# EAGLE design Follower (EAGLE 9.3.2)
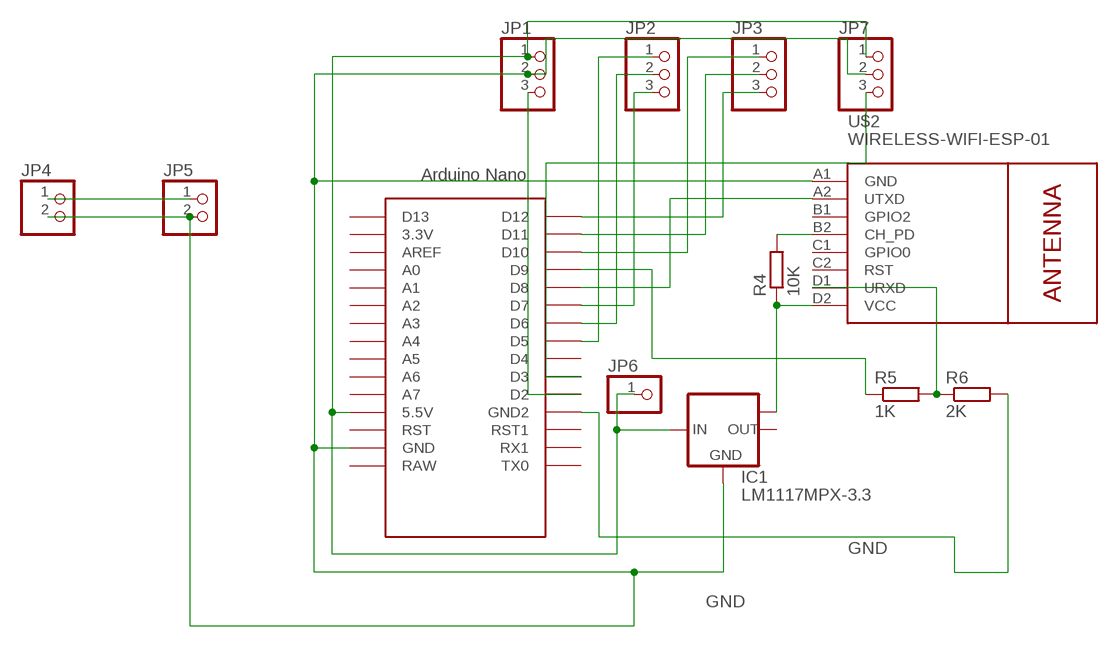
[diagram p0: schematic, sheet 1]

## Parts
IC1  LM1117MPX-3.3  [SOT223]
JP1  PINHD-1X3  [1X03]
JP2  PINHD-1X3  [1X03]
JP3  PINHD-1X3  [1X03]
JP4  PINHD-1X2  [1X02]
JP5  PINHD-1X2  [1X02]
JP6  PINHD-1X1  [1X01]
JP7  PINHD-1X3  [1X03]
R4  10K  R-EU_0207/10  [0207/10]
R5  1K  R-EU_0207/10  [0207/10]
R6  2K  R-EU_0207/10  [0207/10]
U$1  NANO  [NANO]
U$2  WIRELESS-WIFI-ESP-01  [WIRELESS-WIFI-ESP-01]

## Nets
7.4V: JP4.1 JP5.1
GND: IC1.1(GND) JP1.2 JP4.2 JP5.2 JP7.2 R6.2 U$1.GND U$1.GND1(GND2) U$2.A1(GND)
N$1: IC1.3(IN) JP1.1 JP6.1 JP7.1 U$1.5V(5.5V)
N$2: U$1.D8 U$2.A2(UTXD)
N$3: R4.2 U$2.B2(CH_PD)
N$4: IC1.TAB(OUT1) R4.1 U$2.D2(VCC)
N$5: R5.1 U$1.D9
N$6: R5.2 R6.1 U$2.D1(URXD)
N$8: JP2.1 U$1.D5
N$9: JP2.2 U$1.D6
N$10: JP2.3 U$1.D7
N$11: JP3.1 U$1.D10
N$12: JP3.2 U$1.D11
N$13: JP3.3 U$1.D12
N$15: JP1.3 U$1.D2
N$16: JP7.3 U$1.D3
Unconnected: IC1.2(OUT) U$1.3.3V U$1.A0 U$1.A1 U$1.A2 U$1.A3 U$1.A4 U$1.A5 U$1.A6 U$1.A7 U$1.AREF U$1.D4 U$1.D13 U$1.ICSP1 U$1.ICSP2 U$1.ICSP3 U$1.ICSP4 U$1.ICSP5 U$1.ICSP6 U$1.RAW U$1.RST U$1.RST1 U$1.RX1 U$1.TX0 U$2.B1(GPIO2) U$2.C1(GPIO0) U$2.C2(RST)

## Library data of the parts
IC1 = lm1117:LM1117MPX-*
JP1-JP3 JP7 = pinhead:PINHD-1X3: PIN HEADER
JP4 JP5 = pinhead:PINHD-1X2: PIN HEADER
JP6 = pinhead:PINHD-1X1: PIN HEADER
R4-R6 = rcl:R-EU_: RESISTOR, European symbol; SPICEPREFIX: R
U$1 = Arduino-clone:NANO: Arduino Nano
U$2 = diy-modules:WIRELESS-WIFI-ESP-01: Wireless Wi-Fi ESP-01 Module based on ESP8266 chip Click here to find device on ebay.com <http://www.ebay.com/sch/esp8266+esp+01+transceiver>

## Board
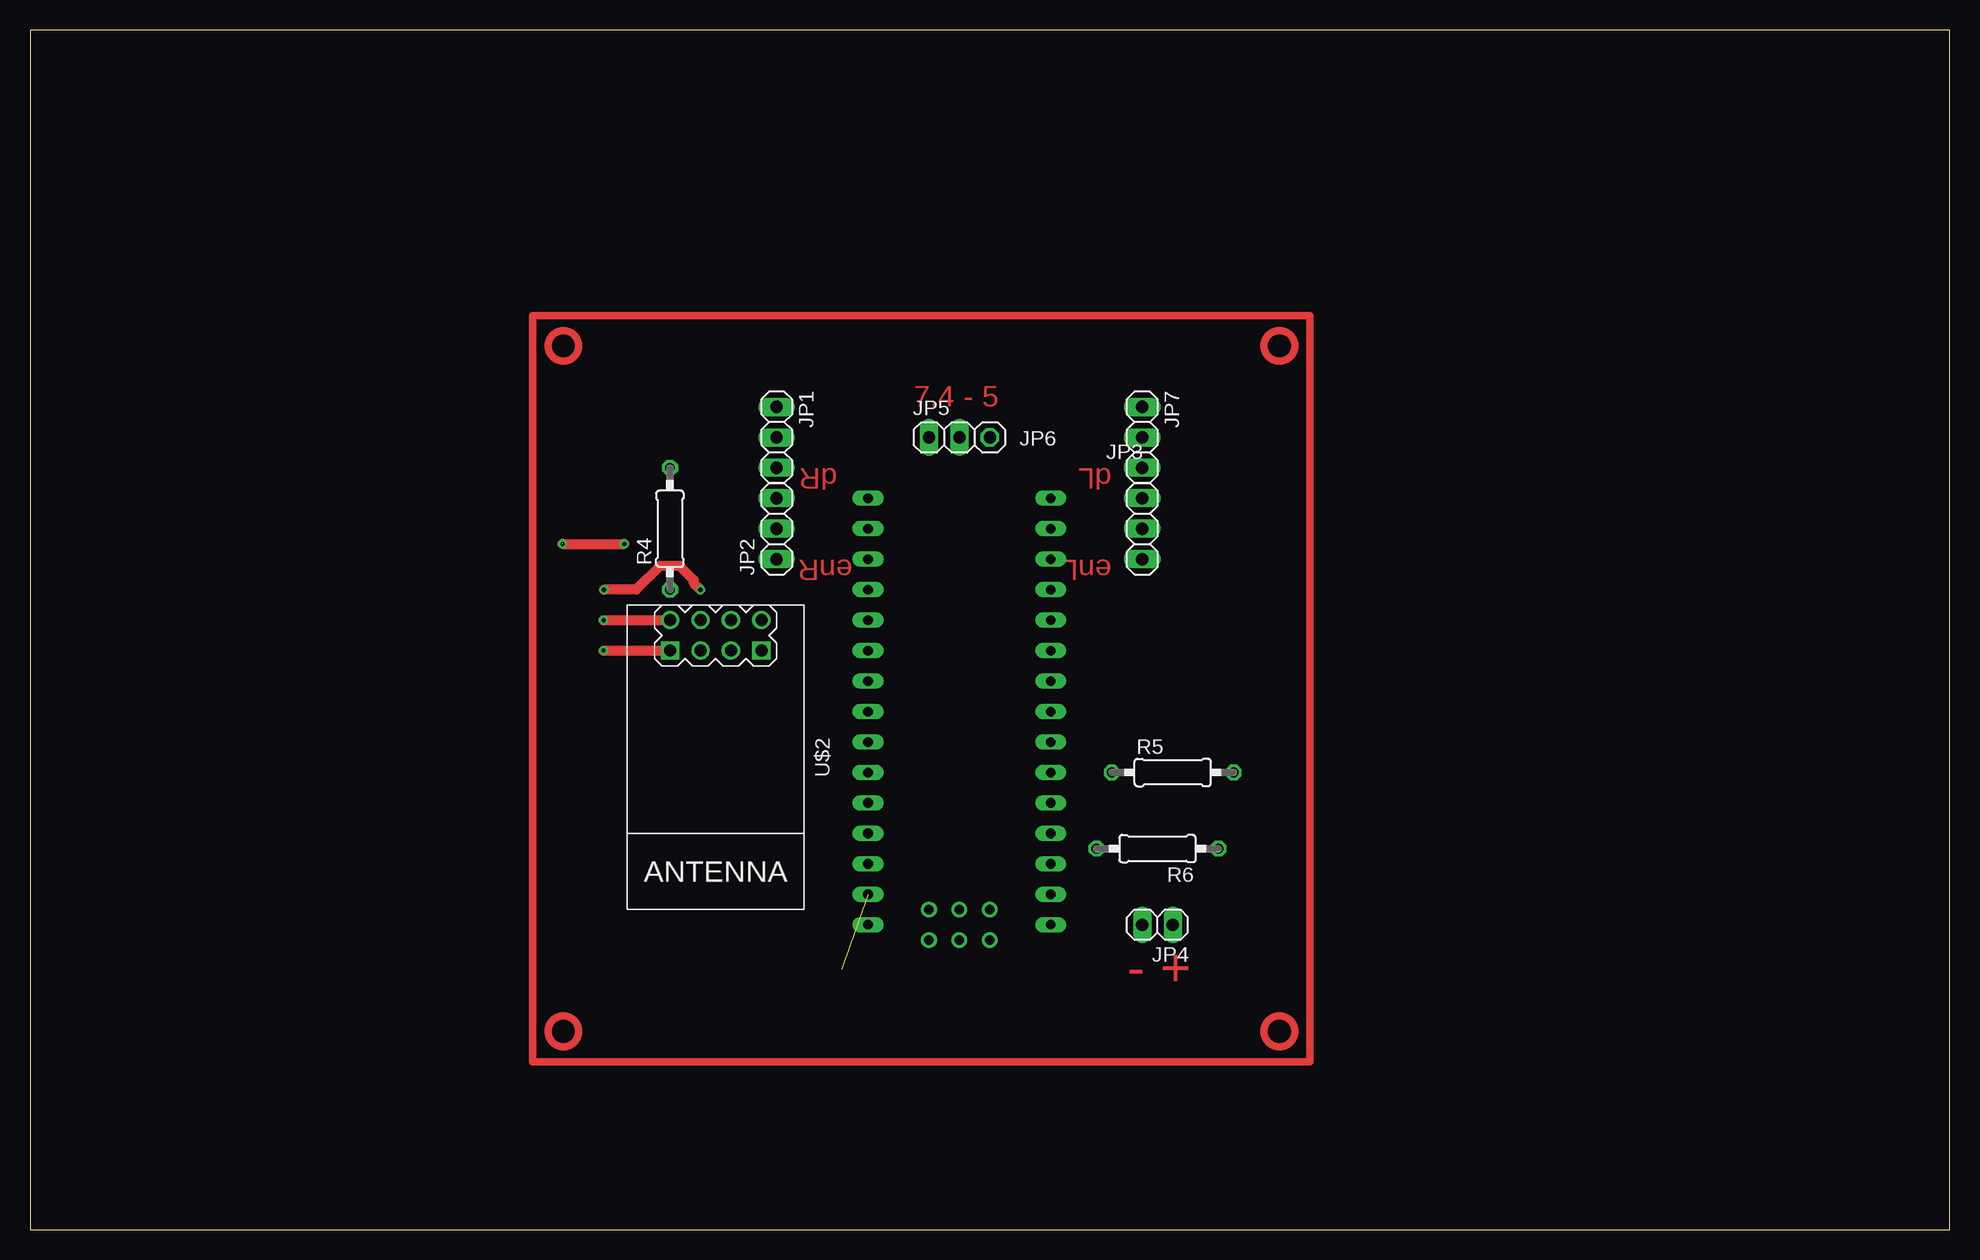
[diagram p1: board, top side]
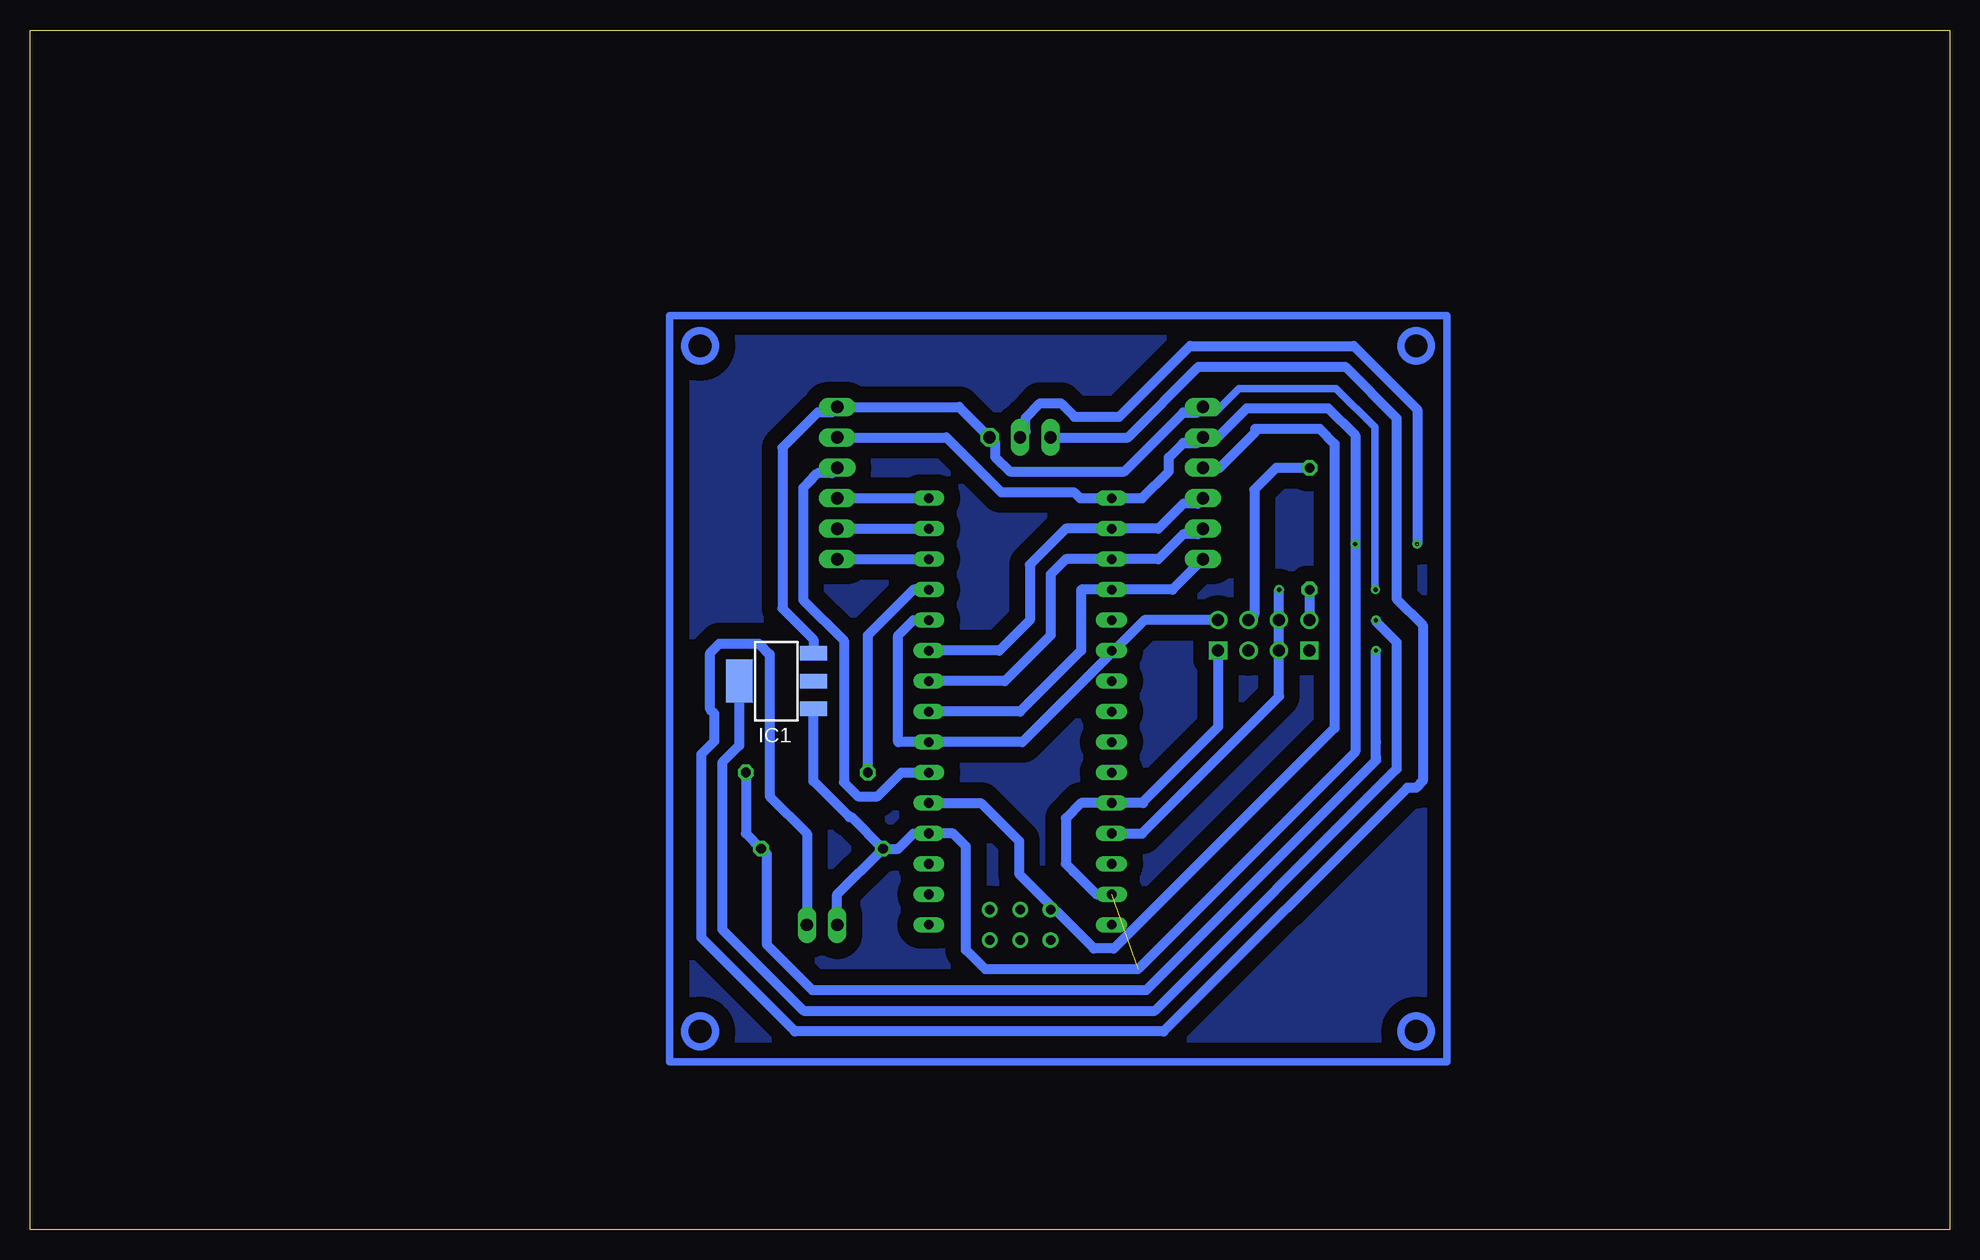
[diagram p2: board, bottom side, seen from below]

Size 160 x 100 mm. Coordinates in mm from the lower left corner, seen from the top.
Outline: 0,0 160,0 160,100 0,100 0,0
Copper layers (1*16): Top 0.035mm / dielectric 1.5mm / Bottom 0.035mm
Design rules "default *": minimum track width 6mil, minimum drill 0.35mm, track to track 52mil, track to pad 52mil, pad to pad 52mil, via to via 52mil, smd to smd 52mil, copper to edge 40mil, drill to drill 6mil, minimum pad ring 10mil, minimum via ring 8mil, stop-mask expansion 4mil, vias tented up to drill 0mil, thermal gap 10mil

### Footprints (pad centres in the part's own frame; a part is rotated, then mirrored left to right if it is on the bottom)
SOT223 = smd 1.219 x 2.235: 1 -2.311,-3.099; 2 0,-3.099; 3 2.311,-3.099 | smd 3.6 x 2.2: TAB 0,3.099
1X03 = drill 1.016 long: 1 -2.54,0; 2 0,0; 3 2.54,0
1X02 = drill 1.016 long: 1 -1.27,0; 2 1.27,0
1X01 = drill 1.016 octagon: 1 0,0
0207/10 = drill 0.813 octagon: 1 -5.08,0; 2 5.08,0
NANO = drill 0.8 long: 3.3V -10.16,24.13; 5V -10.16,-1.27; A0 -10.16,19.05; A1 -10.16,16.51; A2 -10.16,13.97; A3 -10.16,11.43; A4 -10.16,8.89; A5 -10.16,6.35; A6 -10.16,3.81; A7 -10.16,1.27; AREF -10.16,21.59; D2 5.08,1.27; D3 5.08,3.81; D4 5.08,6.35; D5 5.08,8.89; D6 5.08,11.43; D7 5.08,13.97; D8 5.08,16.51; D9 5.08,19.05; D10 5.08,21.59; D11 5.08,24.13; D12 5.08,26.67; D13 -10.16,26.67; GND -10.16,-6.35; GND1 5.08,-1.27; RAW -10.16,-8.89; RST -10.16,-3.81; RST1 5.08,-3.81; RX1 5.08,-6.35; TX0 5.08,-8.89 | drill 0.8: ICSP1 -5.08,-10.16; ICSP2 -5.08,-7.62; ICSP3 -2.54,-10.16; ICSP4 -2.54,-7.62; ICSP5 0,-10.16; ICSP6 0,-7.62
WIRELESS-WIFI-ESP-01 = drill 1 square: A1 -8.89,3.81; D1 -8.89,-3.81 | drill 1: A2 -11.43,3.81; B1 -8.89,1.27; B2 -11.43,1.27; C1 -8.89,-1.27; C2 -11.43,-1.27; D2 -11.43,-3.81

### Placement (x,y rotation side)
IC1  97.79,45.72 90 bottom
JP1  62.23,66.04 270 top
JP2  62.23,58.42 90 top
JP3  92.71,58.42 90 top
JP4  93.98,25.4 180 top
JP5  76.2,66.04 0 top
JP6  80.01,66.04 0 top
JP7  92.71,66.04 270 top
R4  53.34,58.42 90 top
R5  95.25,38.1 0 top
R6  93.98,31.75 180 top
U$1  80.01,34.29 0 top
U$2  57.15,39.37 270 top

### Tracks (layer width: path | path; a pad name or v marks a point on that pad's centre or on a via)
7.4V
  Bottom 0.813: JP5.1 68.48,66.04 62.59,71.93 50.37,71.93 46.08,67.64 46.08,52.58 43.9,50.39 43.9,37.38 44.45,36.83 45.2,36.83 65.52,16.52 96.23,16.52 104.04,24.33 104.04,39.64 102.95,40.72 102.95,43.02 103.31,43.37 103.31,48.07 102.54,48.84 99.24,48.84 98.35,47.95 98.35,36.12 95.25,33.02 JP4.1
GND  (via drill 0.35)  (2 unrouted)
  Top 0.813: v44.38,57.15 v49.54,57.15
  Bottom 0.813: R6.2 87.63,31.75 86.36,33.02 U$1.GND1 83.05,33.02 81.98,31.95 81.98,30.48 81.98,23.31 80.37,21.7 67.66,21.7 49.54,39.82 v49.54,57.15 49.54,66.21 51.8,68.48 58.58,68.48 61.02,66.04 JP1.2 62.69,65.58 63.85,65.58 65.08,64.36 65.08,63.2 67.31,60.96 72.48,60.96 72.99,61.47 79.05,61.47 83.62,66.04 JP7.2 | JP4.2 92.71,27.94 R6.2 | R6.2 91.54,34.39 91.71,34.39 94.69,37.38 IC1.1 | JP5.2 77.01,66.5 77.01,67.67 75.79,68.89 74.07,68.89 72.95,67.77 69.19,67.77 63.3,73.66 49.66,73.66 44.36,68.36 44.36,57.15 | U$2.A1 60.96,41.91 67.22,35.65 67.22,35.56 72.39,35.56 73.66,34.29 73.66,30.48 73.03,29.84 71.12,27.94 U$1.GND
N$1  (via drill 0.35)
  Top 0.813: v55.88,53.34 55.32,53.9 55.32,54.16 54.16,55.32 52.52,55.32 50.54,53.34 v47.84,53.34
  Bottom 0.61: v47.84,53.34 47.91,53.41 47.91,66.89 51.13,70.1 59.25,70.1 61.23,68.12 62.69,68.12
  Bottom 0.813: IC1.3 94.69,49.18 97.28,51.77 97.28,65.18 94.33,68.12 93.17,68.12 JP7.1 82.55,68.58 JP6.1 79.55,65.58 79.55,64.42 78.33,63.2 68.78,63.2 63.85,68.12 62.69,68.12 JP1.1 | U$1.5V 67.31,33.02 55.88,44.45 v55.88,53.34
N$2
  Bottom 0.813: U$2.A2 67.12,50.8 77.28,40.64 87.63,40.64 87.63,49.53 86.36,50.8 U$1.D8
N$3
  Bottom 0.813: U$2.B2 57.95,51.27 57.95,61.69 56.14,63.5 R4.2
N$4  (via drill 0.35)
  Top 0.813: v47.81,50.8 U$2.D2
  Bottom 0.813: R4.1 U$2.D2 | IC1.TAB 100.89,40.34 102.31,38.92 102.31,25.04 95.51,18.24 66.23,18.24 46.08,38.39 46.08,48.98 47.81,50.7 v47.81,50.8
  other vias: 53.34,50.8 53.34,50.8
N$5
  Bottom 0.813: U$1.D9 86.36,53.34 90.17,49.53 R5.1
N$6  (via drill 0.35)
  Top 0.813: v47.81,48.26 U$2.D1
  Bottom 0.813: R5.2 100.33,33.02 R6.1 98.6,31.29 98.6,23.77 94.8,19.97 66.95,19.97 47.9,39.01 47.81,39.11 47.81,39.37 47.81,40.64 v47.81,48.26
N$7
  pour Bottom: 41.91,76.2 41.91,13.97 106.68,13.97 106.68,76.2
  pour Bottom: 106.68,13.97 41.91,13.97 41.91,76.2 106.68,76.2
N$8
  Bottom 0.813: JP2.1 64.77,53.34 72.39,53.34 72.39,48.26 77.47,43.18 U$1.D5
N$9
  Bottom 0.813: JP2.2 62.69,57.96 63.85,57.96 65.94,55.88 73.66,55.88 74.93,54.61 74.93,49.53 78.74,45.72 U$1.D6
N$10
  Bottom 0.813: JP2.3 62.69,60.5 63.85,60.5 65.94,58.42 73.66,58.42 76.66,55.42 76.66,50.8 79.2,48.26 U$1.D7
N$11
  Bottom 0.813: JP3.1 U$1.D10
N$12
  Bottom 0.813: JP3.2 U$1.D11
N$13
  Bottom 0.813: JP3.3 U$1.D12
N$14
  Bottom 0.61: 41.91,76.2 106.68,76.2 106.68,13.97 41.91,13.97 41.91,76.2
N$15
  Bottom 0.813: JP1.3 60.85,63.5 57.86,66.49 57.86,66.75 52.52,66.75 51.27,65.5 51.27,41.81 69.65,23.43 71.32,23.43 77.56,29.66 77.56,32.38 80.74,35.56 U$1.D2
N$16
  Bottom 0.813: JP7.3 93.17,63.04 94.33,63.04 95.2,62.18 95.56,61.82 95.56,52.49 92.15,49.09 92.15,37.28 90.99,36.12 89.35,36.12 87.37,38.1 U$1.D3
N$17
  Top 0.61: 41.91,76.2 106.68,76.2 106.68,13.97 41.91,13.97 41.91,76.2
(copper drawn outside any net)
  shapes: Bottom circle x4, Top circle x4

### Text on the board
Top: 7.4 - 5 | dR | dL | enR | enL | - +